# Altium project SolarPanel7Cells.PrjPcb
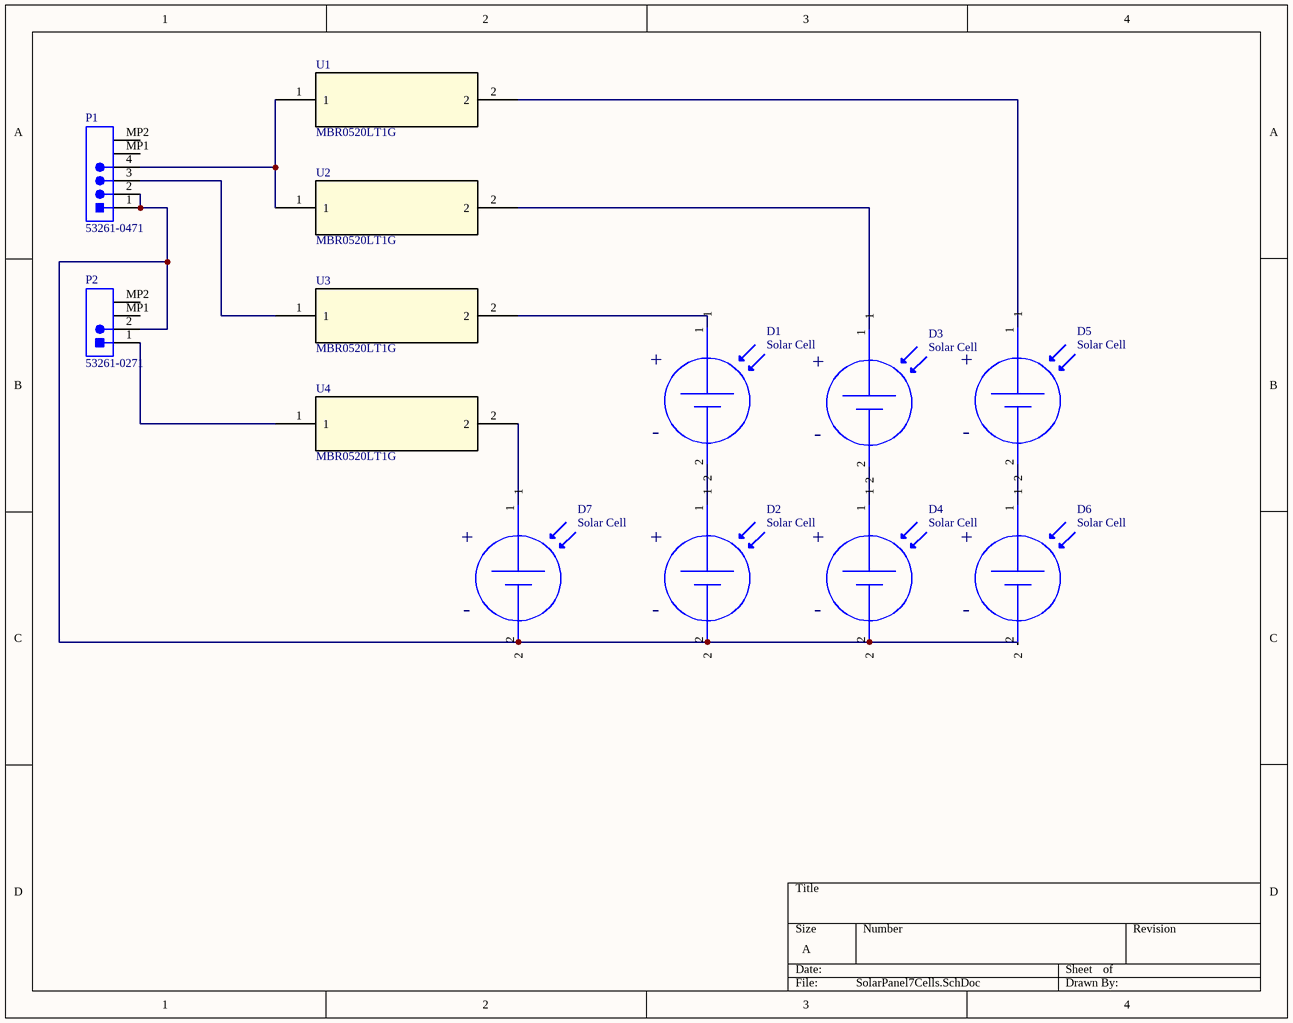
[diagram p0: SolarPanel7Cells.SchDoc]
1 sheet, 13 parts. Net scope: global (net labels, ports and power ports of the same name join across sheets).
Board file: SolarPanel7Cells.PcbDoc

## Sheet SolarPanel7Cells.SchDoc
size A

### Parts
D1  Solar Cell
D2  Solar Cell
D3  Solar Cell
D4  Solar Cell
D5  Solar Cell
D6  Solar Cell
D7  Solar Cell
P1  53261-0471  [MOLEX-53261-0471_V]
P2  53261-0271  [MOLX-53261-0271_V]
U1  MBR0520LT1G  [SOD-123]
U2  MBR0520LT1G  [SOD-123]
U3  MBR0520LT1G  [SOD-123]
U4  MBR0520LT1G  [SOD-123]

### Nets
NetD1_1: D1.1 U3.2
NetD1_2: D1.2 D2.1
NetD2_2: D2.2 D4.2 D6.2 D7.2 P1.1 P1.2 P2.2
NetD3_1: D3.1 U2.2
NetD3_2: D3.2 D4.1
NetD5_1: D5.1 U1.2
NetD5_2: D5.2 D6.1
NetD7_1: D7.1 U4.2
NetP1_3: P1.3 U3.1
NetP1_4: P1.4 U1.1 U2.1
NetP2_1: P2.1 U4.1

Not connected (* = marked no-connect by the designer): P1 MP1 MP2; P2 MP1 MP2

### Notes on the sheet
- (in symbol SolAeroBJTSpaceSolarCell) +; -

### Library data of the parts
D1-D7 = SolAeroBJTSpaceSolarCell: SolAero BJT Space Solar Cell
P1 = CMP-2000-05238-1: Male Header, Pitch 1.25 mm, 1 x 4 Position, Height 3.4 mm, -40 to 85 degC, RoHS, Tape and Reel; Current Rating: 1A; Brand: Molex; Number of Positions / Contacts: 4; Pitch: 1.25mm; Voltage Rating: 125V; Mounting Angle: Right; Manufacturer URL: http://www.molex.com/; Factory Pack Quantity: 1000; Housing Material: Thermoplastic; Datasheet URL: http://www.molex.com/pdm_docs/sd/532610471_sd.pdf; Tradename: PicoBlade; Product Type: Headers; Contact Plating: Tin; Contact Material: PhosphorBronze; Package Description: 1.25mm Pitch PicoBlade(TM) Header, Surface Mount, Right Angle, Lead-Free, 4 Circuits; Mounting Style: SMD/SMT; Manufacturer: Molex; Series: 53261; Packaging: Reel; Number of Rows: 1; RoHS: Details; Number of Positions: 4; Product Category: Headers&WireHousings; Datasheet Version: Rev. G, 01/2012; Type: Shrouded; Termination Style: SMD
P2 = CMP-2000-05633-1: PicoBlade(TM) Header, Right Angle, -40 to 85 degC, 2-Pin SMD, RoHS, Tape and Reel; Current - Max: 1A; Brand: Molex; Voltage Rating: 125V; Number of Positions: 2; Pitch: 1.25mm; Package Version: Rev. H, 11/2014; Factory Pack Quantity: 1000; Datasheet URL: http://www.molex.com/webdocs/datasheets/pdf/en-us/0532610271_PCB_HEADERS.pdf; Datasheet Version: 03/2016; Housing Material: Thermoplastic; RoHS: Details; Product Type: Headers; Number of Rows: 1; Termination Style: SMD; Mounting Technology: SurfaceMount; Number of Positions / Contacts: 2; Package URL: http://www.molex.com/pdm_docs/sd/532610271_sd.pdf; Mounting Angle: Right; Mounting Style: SMD/SMT; Manufacturer: Molex; Product Category: 1.25mmConnectors; Tradename: PicoBlade; Voltage - Max: 125V; Manufacturer URL: http://www.molex.com/; Series: 53261; Package Description: 2-Leads Header, Pitch 1.25 mm, Mated Height 3.4 mm; Package Reference: 53261-0271; Current Rating: 1A; Contact Plating: Tin; Contact Material: PhosphorBronze; Type: Shrouded; Packaging: Reel
U1-U4 = MBR0520LT1G: Imported; Vendor: ON Semiconductor; C: Copyright (C) 2015 Accelerated Designs. All rights reserved; Manufacturer_Part_Number: MBR0520LT1G; Copyright: Copyright (C) 2015 Accelerated Designs. All rights reserved; Value: Value; Type: Type; RefDes: RefDes